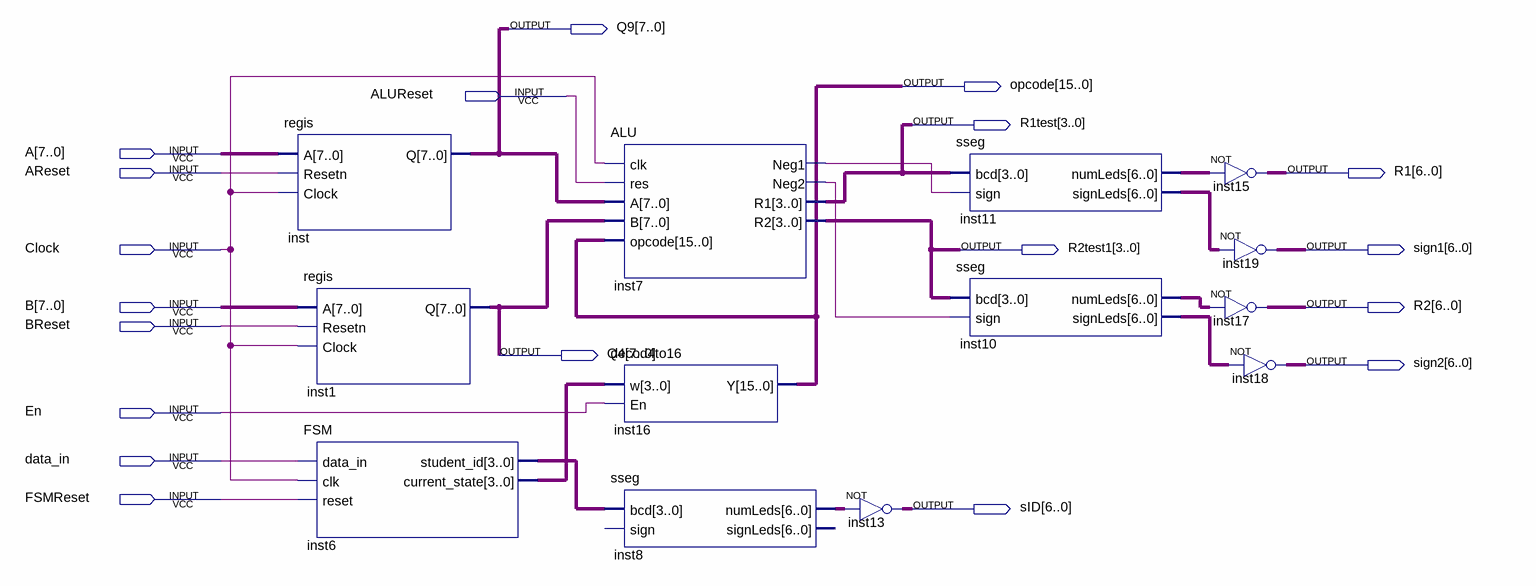
[diagram p0: schematic sheet]
// Quartus schematic lab6.bdf as structural Verilog: 13 symbols, 19 pins
module lab6 (
  input  ALUReset,
  input  [7:0] A,
  input  AReset,
  input  Clock,
  input  [7:0] B,
  input  BReset,
  input  En,
  input  data_in,
  input  FSMReset,
  output [7:0] Q9,
  output [15:0] opcode,
  output [3:0] R1test,
  output [6:0] R1,
  output [3:0] R2test1,
  output [6:0] sign1,
  output [6:0] R2,
  output [7:0] Q4,
  output [6:0] sign2,
  output [6:0] sID
);

  wire inst7_neg1, inst7_neg2;
  wire [3:0] inst6_current_state, inst6_student_id;
  wire [6:0] inst8_numleds, inst10_numleds, inst10_signleds, inst11_numleds, inst11_signleds;

  regis inst (.A(A), .Resetn(AReset), .Clock(Clock), .Q(Q9));
  regis inst1 (.A(B), .Resetn(BReset), .Clock(Clock), .Q(Q4));
  FSM inst6 (
    .data_in(data_in), .clk(Clock), .reset(FSMReset), .student_id(inst6_student_id),
    .current_state(inst6_current_state));
  ALU inst7 (
    .clk(Clock), .res(ALUReset), .A(Q9), .B(Q4), .opcode(opcode), .Neg1(inst7_neg1), .Neg2(inst7_neg2),
    .R1(R1test), .R2(R2test1));
  decod4to16 inst16 (.w(inst6_current_state), .En(En), .Y(opcode));
  sseg inst8 (.bcd(inst6_student_id), .numLeds(inst8_numleds));  // open: sign, signLeds
  assign sID = ~inst8_numleds;  // NOT inst13, 7 bits wide
  sseg inst11 (.bcd(R1test), .sign(inst7_neg1), .numLeds(inst11_numleds), .signLeds(inst11_signleds));
  sseg inst10 (.bcd(R2test1), .sign(inst7_neg2), .numLeds(inst10_numleds), .signLeds(inst10_signleds));
  assign R1 = ~inst11_numleds;  // NOT inst15, 7 bits wide
  assign sign1 = ~inst11_signleds;  // NOT inst19, 7 bits wide
  assign R2 = ~inst10_numleds;  // NOT inst17, 7 bits wide
  assign sign2 = ~inst10_signleds;  // NOT inst18, 7 bits wide
endmodule
